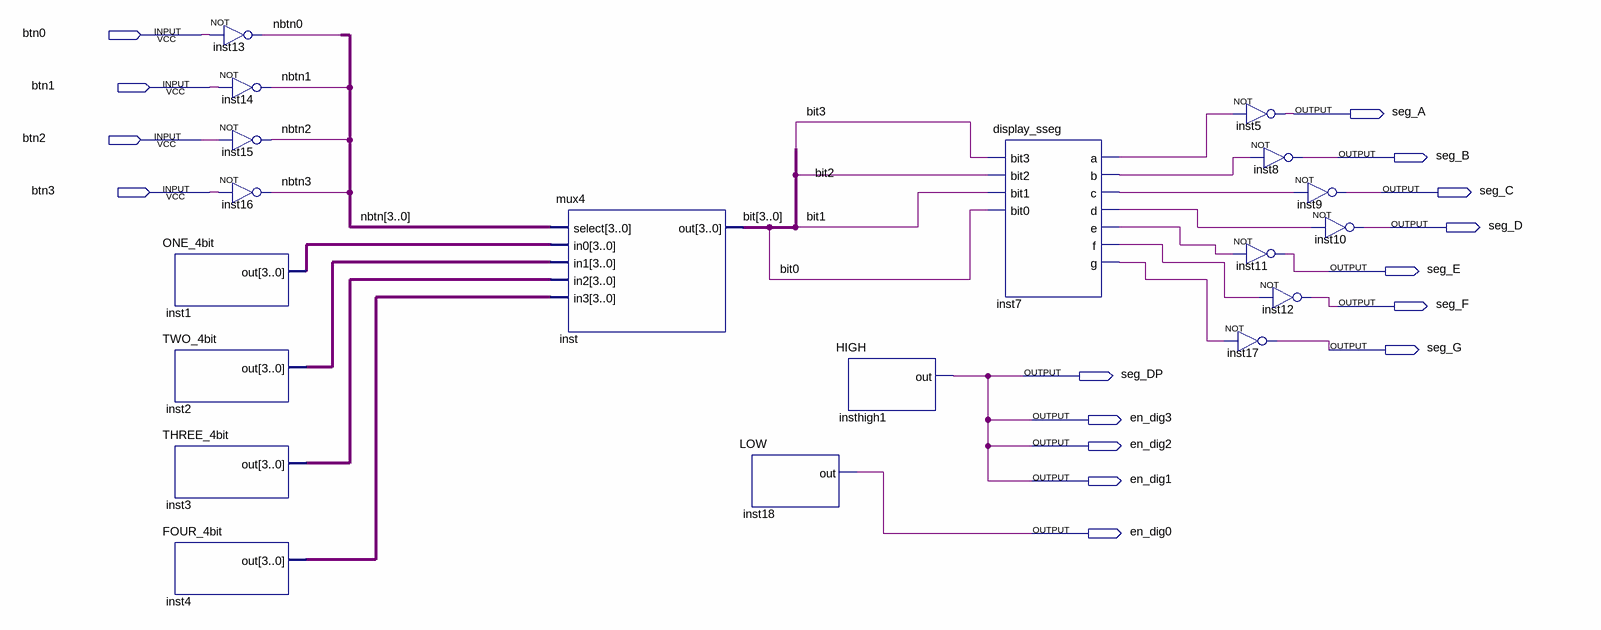
[diagram p0: schematic sheet]
// Quartus schematic test_mux4_sseg.bdf as structural Verilog: 19 symbols, 16 pins
module test_mux4_sseg (
  input  btn0,
  input  btn1,
  input  btn2,
  input  btn3,
  output seg_A,
  output seg_B,
  output seg_C,
  output seg_D,
  output seg_E,
  output seg_F,
  output seg_G,
  output seg_DP,
  output en_dig3,
  output en_dig2,
  output en_dig1,
  output en_dig0
);

  wire inst7_a, inst7_b, inst7_c, inst7_d, inst7_e, inst7_f, inst7_g;
  wire [3:0] \bit , inst1_out, inst2_out, inst3_out, inst4_out, nbtn;

  not inst13 (nbtn[0], btn0);
  not inst14 (nbtn[1], btn1);
  not inst15 (nbtn[2], btn2);
  not inst16 (nbtn[3], btn3);
  ONE_4bit inst1 (.out(inst1_out));
  TWO_4bit inst2 (.out(inst2_out));
  THREE_4bit inst3 (.out(inst3_out));
  FOUR_4bit inst4 (.out(inst4_out));
  mux4 inst (.select(nbtn), .in0(inst1_out), .in1(inst2_out), .in2(inst3_out), .in3(inst4_out), .out(\bit ));
  LOW inst18 (.out(en_dig0));
  HIGH insthigh1 (.out(en_dig1));
  display_sseg inst7 (
    .bit3(\bit [3]), .bit2(\bit [2]), .bit1(\bit [1]), .bit0(\bit [0]), .a(inst7_a), .b(inst7_b),
    .c(inst7_c), .d(inst7_d), .e(inst7_e), .f(inst7_f), .g(inst7_g));
  not inst5 (seg_A, inst7_a);
  not inst8 (seg_B, inst7_b);
  not inst11 (seg_E, inst7_e);
  not inst12 (seg_F, inst7_f);
  not inst17 (seg_G, inst7_g);
  not inst9 (seg_C, inst7_c);
  not inst10 (seg_D, inst7_d);

  assign en_dig2 = en_dig1;
  assign en_dig3 = en_dig1;
  assign seg_DP = en_dig1;
endmodule
